# EAGLE board Panel (EAGLE 7.5.0)
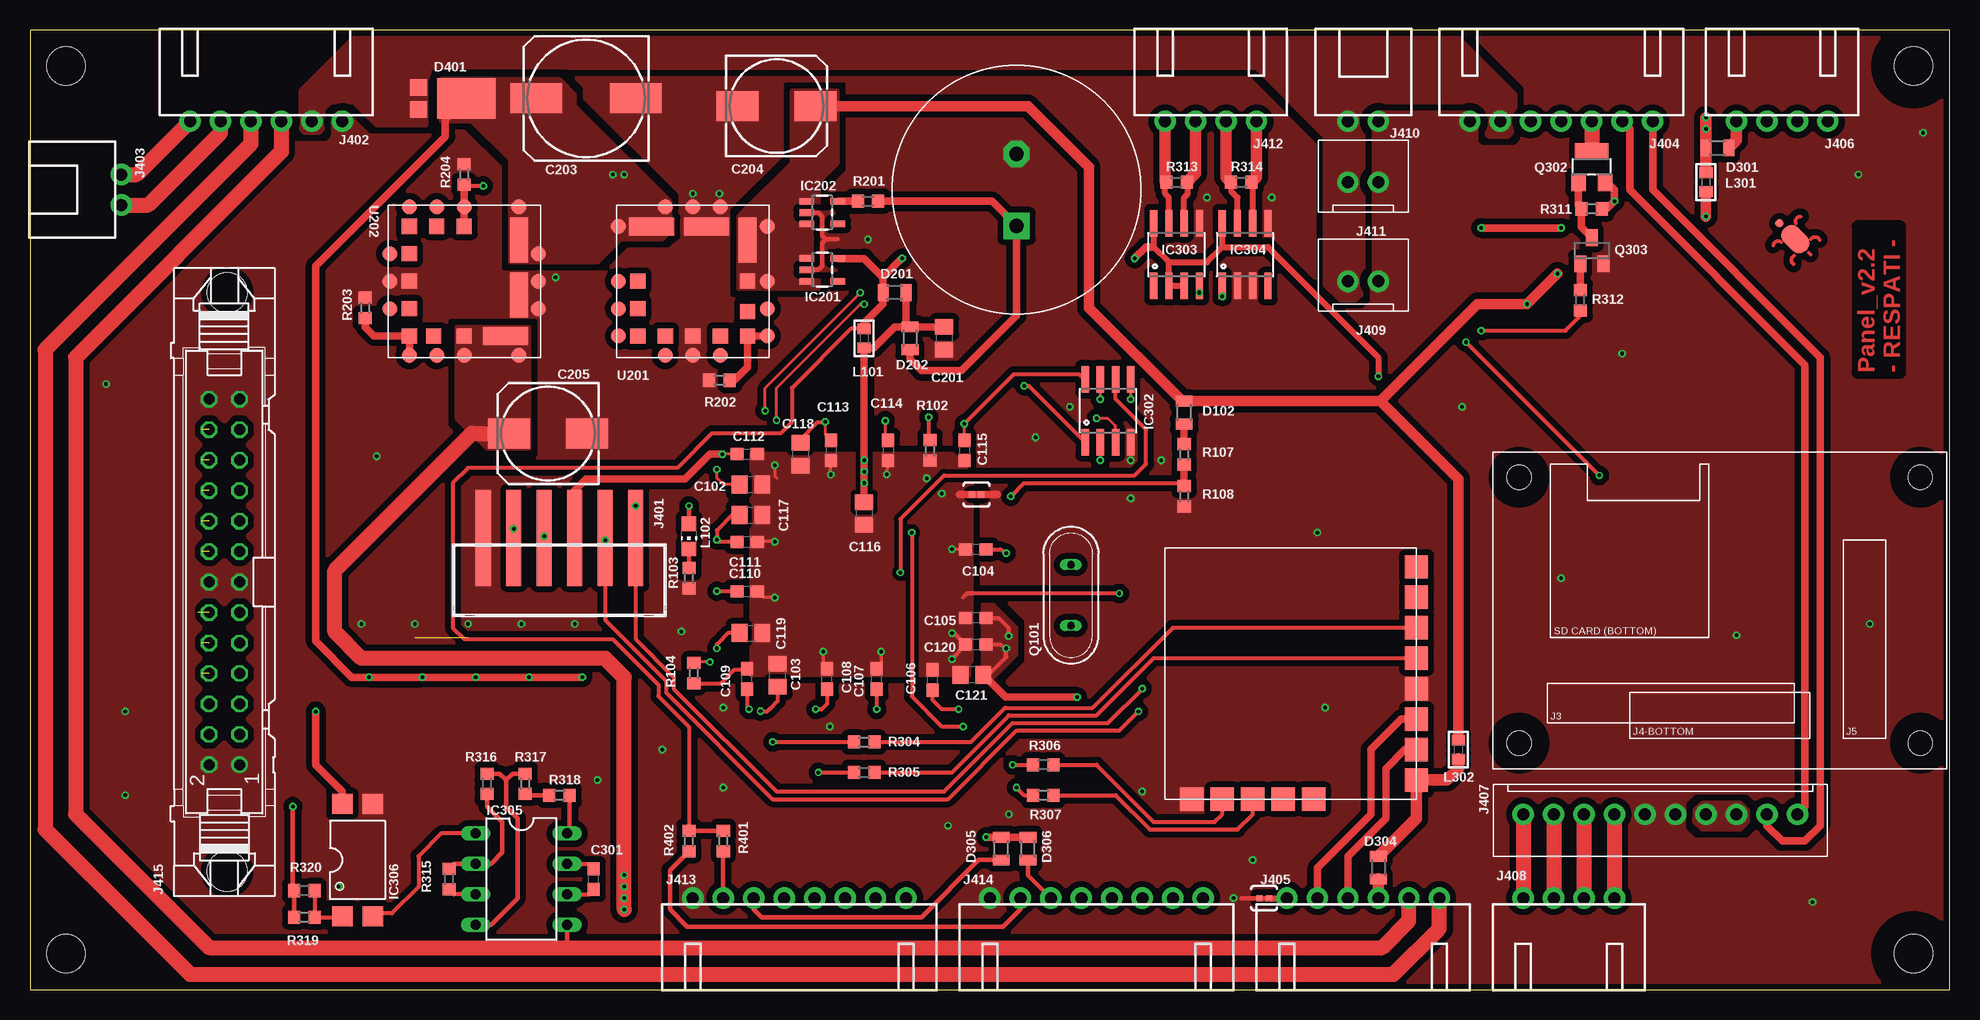
[diagram p4: board, top side]
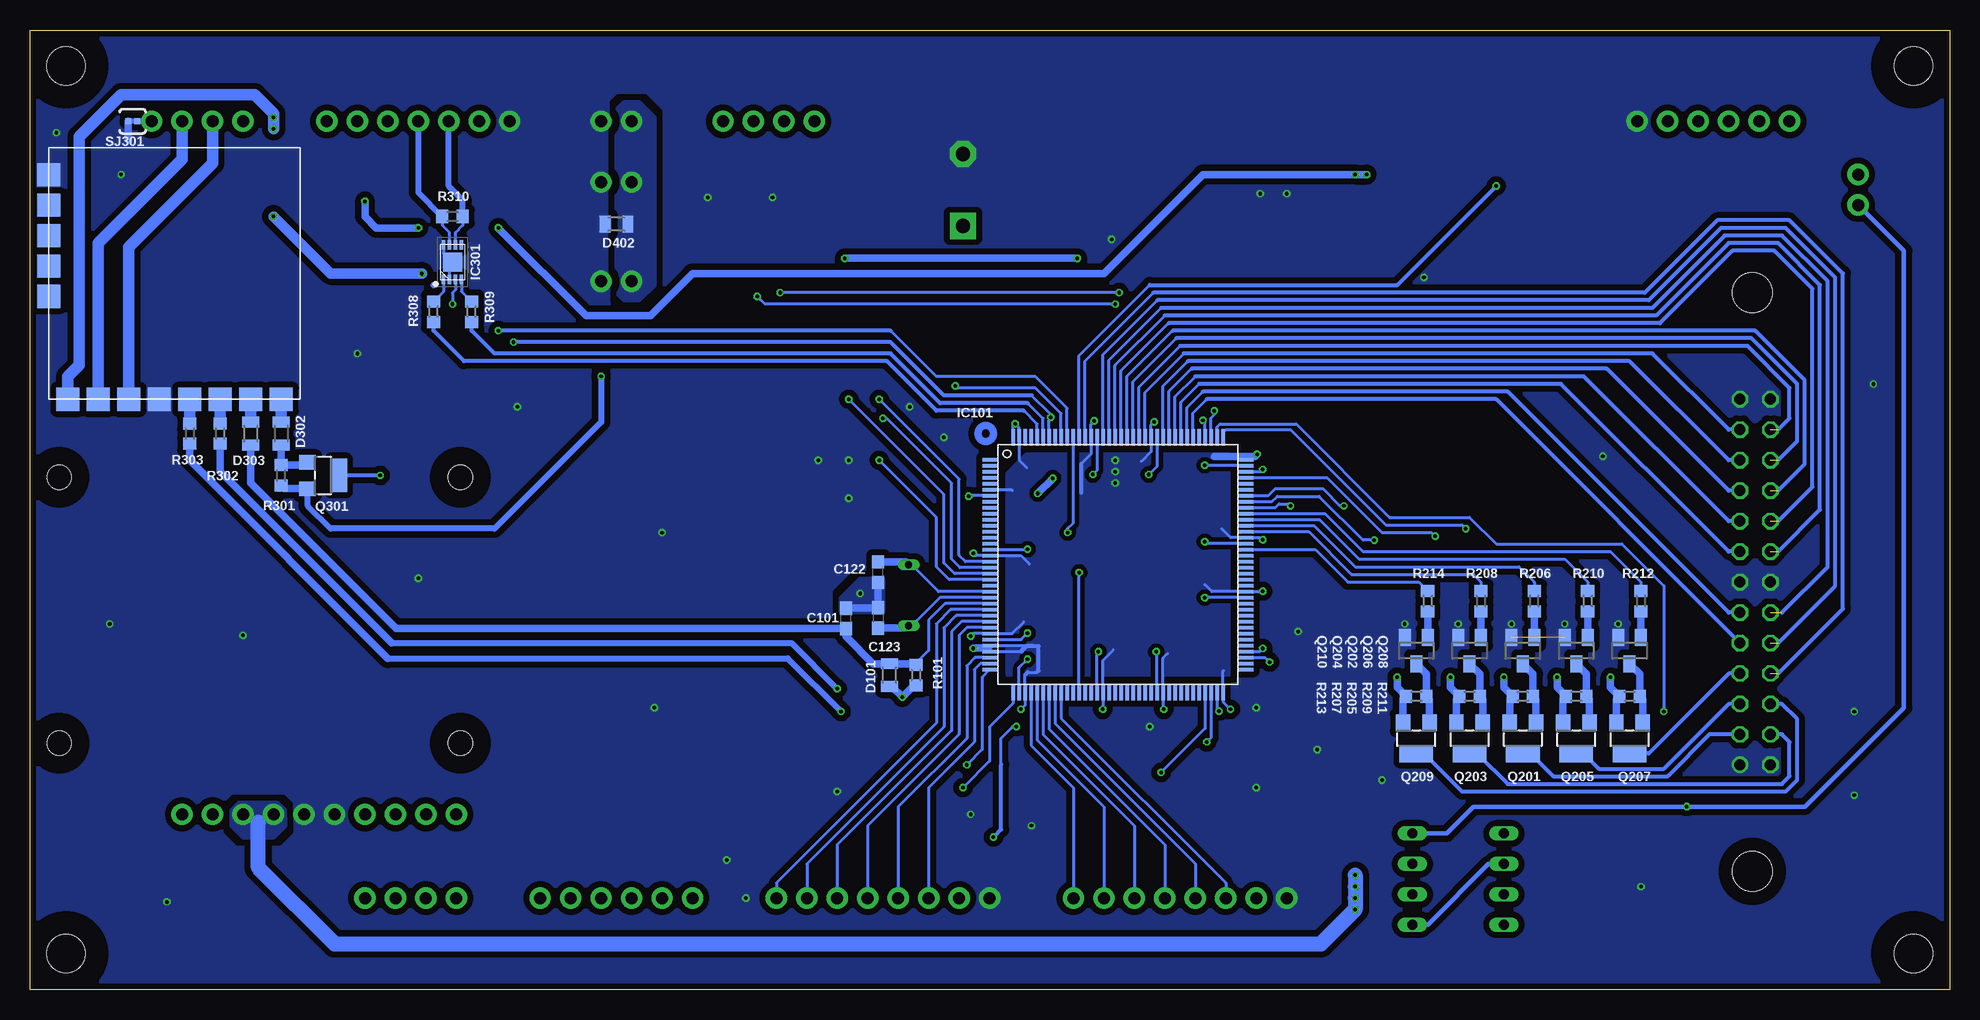
[diagram p5: board, bottom side, seen from below]

Size 160 x 80 mm. Coordinates in mm from the lower left corner, seen from the top.
Outline: 0,0 160,0 160,80 0,80 0,0
Copper layers (1*16): Top 0.035mm / dielectric 1.5mm / Bottom 0.035mm
Design rules "pcbgogo": minimum track width 6mil, minimum drill 0.3mm, track to track 6mil, track to pad 6mil, pad to pad 6mil, via to via 6mil, smd to smd 0mil, copper to edge 0.4mm, drill to drill 0.25mm, minimum pad ring 6mil, minimum via ring 6mil, stop-mask expansion 4mil, vias tented up to drill 0.35mm, thermal gap 10mil
Net classes: 0 default: width 0.203 mm, drill 0.29 mm, clearance 0.203 mm; 1 ic: width 0.203 mm, drill 0.29 mm, clearance 0.203 mm; 2 power: width 0.381 mm, drill 0.29 mm, clearance 0.635 mm
Holes 3.2 mm at 3,3 3,77 157,3 157,77
tRestrict: area 0,0 to 6,6; area 0,74 to 6,80; area 154,0 to 160,6; area 154,74 to 160,80
bRestrict: area 0,0 to 6,6; area 0,74 to 6,80; area 154,0 to 160,6; area 154,74 to 160,80

## Footprints (pad centres in the part's own frame; a part is rotated, then mirrored left to right if it is on the bottom)
C0603 = smd 1.1 x 1: 1 -0.85,0; 2 0.85,0
C0805 = smd 1.3 x 1.5: 1 -0.95,0; 2 0.95,0
SC_1F/5V5 = drill 1.2 pad 2.184 square: 1 3,0 | drill 1.2 pad 2.184 octagon: 2 -3,0
153CLV-1012 = smd 4.3 x 2.5: + 4.15,0; - -4.15,0
153CLV-0810 = smd 3.5 x 2.5: + 3.25,0; - -3.25,0
MICROMELF-W = smd 0.9 x 1.4: A 0.95,0; C -0.95,0
POWERDI5-3 = smd 1.39 x 1.4: 1 0.92,-2.856; 2 -0.92,-2.856 | smd 3.36 x 4.86: 3 0,1.126
LQFP144-2 = smd 0.297 x 1.35: 1 -8.75,-10.625; 2 -8.25,-10.625; 3 -7.75,-10.625; 4 -7.25,-10.625; 5 -6.75,-10.625; 6 -6.25,-10.625; 7 -5.75,-10.625; 8 -5.25,-10.625; 9 -4.75,-10.625; 10 -4.25,-10.625; 11 -3.75,-10.625; 12 -3.25,-10.625; 13 -2.75,-10.62; 14 -2.25,-10.625; 15 -1.75,-10.625; 16 -1.25,-10.625; 17 -0.75,-10.625; 18 -0.25,-10.625; 19 0.25,-10.625; 20 0.75,-10.625; 21 1.25,-10.625; 22 1.75,-10.625; 23 2.25,-10.625; 24 2.75,-10.62; 25 3.25,-10.625; 26 3.75,-10.625; 27 4.25,-10.625; 28 4.75,-10.625; 29 5.25,-10.625; 30 5.75,-10.625; 31 6.25,-10.625; 32 6.75,-10.625; 33 7.25,-10.625; 34 7.75,-10.625; 35 8.25,-10.625; 36 8.75,-10.625; 73 8.75,10.625; 74 8.25,10.625; 75 7.75,10.625; 76 7.25,10.625; 77 6.75,10.625; 78 6.25,10.625; 79 5.75,10.625; 80 5.25,10.625; 81 4.75,10.625; 82 4.25,10.625; 83 3.75,10.625; 84 3.25,10.625; 85 2.75,10.625; 86 2.25,10.625; 87 1.75,10.625; 88 1.25,10.625; 89 0.75,10.625; 90 0.25,10.625; 91 -0.25,10.625; 92 -0.75,10.625; 93 -1.25,10.625; 94 -1.75,10.625; 95 -2.25,10.625; 96 -2.75,10.625; 97 -3.25,10.625; 98 -3.75,10.625; 99 -4.25,10.625; 100 -4.75,10.625; 101 -5.25,10.625; 102 -5.75,10.625; 103 -6.25,10.625; 104 -6.75,10.625; 105 -7.25,10.625; 106 -7.75,10.625; 107 -8.25,10.625; 108 -8.75,10.625 | smd 1.35 x 0.297: 37 10.625,-8.75; 38 10.625,-8.25; 39 10.625,-7.75; 40 10.625,-7.25; 41 10.625,-6.75; 42 10.625,-6.25; 43 10.625,-5.75; 44 10.625,-5.25; 45 10.625,-4.75; 46 10.625,-4.25; 47 10.625,-3.75; 48 10.625,-3.25; 49 10.625,-2.75; 50 10.625,-2.25; 51 10.625,-1.75; 52 10.625,-1.25; 53 10.625,-0.75; 54 10.625,-0.25; 55 10.625,0.25; 56 10.625,0.75; 57 10.625,1.25; 58 10.625,1.75; 59 10.625,2.25; 60 10.625,2.75; 61 10.625,3.25; 62 10.625,3.75; 63 10.625,4.25; 64 10.625,4.75; 65 10.625,5.25; 66 10.625,5.75; 67 10.625,6.25; 68 10.625,6.75; 69 10.625,7.25; 70 10.625,7.75; 71 10.625,8.25; 72 10.625,8.75; 109 -10.625,8.75; 110 -10.625,8.25; 111 -10.625,7.75; 112 -10.625,7.25; 113 -10.625,6.75; 114 -10.625,6.25; 115 -10.625,5.75; 116 -10.625,5.25; 117 -10.625,4.75; 118 -10.625,4.25; 119 -10.625,3.75; 120 -10.625,3.25; 121 -10.625,2.75; 122 -10.625,2.25; 123 -10.625,1.75; 124 -10.625,1.25; 125 -10.625,0.75; 126 -10.625,0.25; 127 -10.625,-0.25; 128 -10.625,-0.75; 129 -10.625,-1.25; 130 -10.625,-1.75; 131 -10.625,-2.25; 132 -10.625,-2.75; 133 -10.625,-3.25; 134 -10.625,-3.75; 135 -10.625,-4.25; 136 -10.625,-4.75; 137 -10.625,-5.25; 138 -10.625,-5.75; 139 -10.625,-6.25; 140 -10.625,-6.75; 141 -10.625,-7.25; 142 -10.625,-7.75; 143 -10.625,-8.25; 144 -10.625,-8.75
SOT23-5 = smd 0.55 x 1.2: 1 -0.95,-1.3; 2 0,-1.3; 3 0.95,-1.3; 4 0.95,1.3; 5 -0.95,1.3
TDFN-8 = smd 0.8 x 0.29: 1 -1.45,0.75; 2 -1.45,0.25; 3 -1.45,-0.25; 4 -1.45,-0.75; 5 1.45,-0.75; 6 1.45,-0.25; 7 1.45,0.25; 8 1.45,0.75 | smd 1.6 x 1.6: 9 0,0
SO08 = smd 0.61 x 2.21: 1 -1.905,-2.616; 2 -0.635,-2.616; 3 0.635,-2.616; 4 1.905,-2.616; 5 1.905,2.616; 6 0.635,2.616; 7 -0.635,2.616; 8 -1.905,2.616
DIL08 = drill 0.813 long: 1 -3.81,-3.81; 2 -1.27,-3.81; 3 1.27,-3.81; 4 3.81,-3.81; 5 3.81,3.81; 6 1.27,3.81; 7 -1.27,3.81; 8 -3.81,3.81
PC817SMD = smd 1.68 x 1.71: 1 -4.695,1.27; 2 -4.695,-1.27; 3 4.695,-1.27; 4 4.695,1.27
XHS-6-VERT-SMD = smd 1.27 x 8: 1 6.35,0.5; 2 3.81,0.5; 3 1.27,0.5; 4 -1.27,0.5; 5 -3.81,0.5; 6 -6.35,0.5
XHS-6-RA = drill 1 pad 1.778: 1 6.35,0; 2 3.81,0; 3 1.27,0; 4 -1.27,0; 5 -3.81,0; 6 -6.35,0
XHS-2-RA = drill 1 pad 1.778: 1 1.27,0; 2 -1.27,0
XHS-7-RA = drill 1 pad 1.778: 1 7.62,0; 2 5.08,0; 3 2.54,0; 4 0,0; 5 -2.54,0; 6 -5.08,0; 7 -7.62,0
XHS-4-RA = drill 1 pad 1.778: 1 3.81,0; 2 1.27,0; 3 -1.27,0; 4 -3.81,0
XHS-10-VERT = drill 1 pad 1.778: 1 11.43,0; 2 8.89,0; 3 6.35,0; 4 3.81,0; 5 1.27,0; 6 -1.27,0; 7 -3.81,0; 8 -6.35,0; 9 -8.89,0; 10 -11.43,0
XHS-2-VERT = drill 1 pad 1.778: 1 1.27,0; 2 -1.27,0
XHS-8-RA = drill 1 pad 1.778: 1 8.89,0; 2 6.35,0; 3 3.81,0; 4 1.27,0; 5 -1.27,0; 6 -3.81,0; 7 -6.35,0; 8 -8.89,0
26V = drill 0.914: 1 -15.24,-1.27 | drill 0.914 octagon: 2 -15.24,1.27; 3 -12.7,-1.27; 4 -12.7,1.27; 5 -10.16,-1.27; 6 -10.16,1.27; 7 -7.62,-1.27; 8 -7.62,1.27; 9 -5.08,-1.27; 10 -5.08,1.27; 11 -2.54,-1.27; 12 -2.54,1.27; 13 0,-1.27; 14 0,1.27; 15 2.54,-1.27; 16 2.54,1.27; 17 5.08,-1.27; 18 5.08,1.27; 19 7.62,-1.27; 20 7.62,1.27; 21 10.16,-1.27; 22 10.16,1.27; 23 12.7,-1.27; 24 12.7,1.27; 25 15.24,-1.27; 26 15.24,1.27 | hole 3.302: 24.13,-0.254; -24.13,-0.254
L0603 = smd 0.9 x 1.1: 1 -0.794,0; 2 0.794,0
CHIP-LED0805 = smd 1.2 x 1.2: A 0,-1.05; C 0,1.05
QS = drill 0.61 long: 1 -2.54,0; 2 2.54,0
SOT23-W = smd 1.2 x 1.4: 1 -1.1,-1.3; 2 1.1,-1.3 | smd 2.8 x 1.4: 3 0,1.3
SOT23 = smd 1 x 1.4: 1 -0.95,-1.1; 2 0.95,-1.1; 3 0,1.1
R0603 = smd 1 x 1.1: 1 -0.85,0; 2 0.85,0
SJ_2S-TRACE_THICK = smd 0.5 x 0.5: 1 -0.381,0; 2 0.381,0
OKL2T/3W5NC = smd 1.27 x 1.27: 1 -6.2,0; 1@1 -4.57,0; 2 -2.29,6.2; 2@1 -6.2,4.57; 3 0,6.2; 3@1 2.29,6.2; 4 6.2,4.57; 5 6.2,0; 5@1 4.57,0; 6 6.2,-4.57; 6@1 4.57,-4.57; 7 0,-6.2; 7@1 0,-4.57; 8 -2.29,-6.2; 8@1 -2.29,-4.57; 9 -6.2,-4.57; 9@1 -4.57,-4.57; 10 -6.2,-2.29; 10@1 -4.57,-2.29; 11 6.2,-2.29; 11@1 4.57,-2.54; 12 2.29,-6.2; 12@1 2.29,-4.57 | smd 3.75 x 1.5: 2@2 -3.43,4.57; 3@2 1.14,4.57 | smd 1.5 x 3.75: 4@1 4.57,3.43
MOD_CP2105_BOARD = smd 1.93 x 1.93: 1 -10.477,8.89; 2 -10.477,6.35; 3 -10.477,3.81; 4 -10.477,1.27; 5 -10.477,-1.27; 6 -10.477,-3.81; 7 -10.477,-6.35; 8 -10.477,-8.89; 9 8.255,10.477; 10 5.715,10.477; 11 3.175,10.477; 12 0.635,10.477; 13 -1.905,10.477
SLA-1500-OEM = hole 2: 2.21,2.121; 2.21,24.295; 35.636,24.295; 35.636,2.121
KURRO-LOGO = smd 2.54 x 1.651 rotated 45 bottom: P$1 0,0 | smd 0.635 x 0.635 rotated 45 bottom: P$2 1.347,1.347

## Placement (x,y rotation side)
C101  100n  [C0603]  91.98,30.93 90 bottom
C102  2u2  [C0805]  60.1,42.09 0 top
C103  2u2  [C0805]  62.32,26.22 90 top
C104  100n  [C0603]  78.83,36.69 180 top
C105  100n  [C0603]  78.83,30.98 180 top
C106  100n  [C0603]  75.23,25.81 90 top
C107  100n  [C0603]  70.58,25.9 90 top
C108  100n  [C0603]  66.45,25.9 90 top
C109  100n  [C0603]  59.78,25.9 90 top
C110  100n  [C0603]  59.78,33.2 0 top
C111  100n  [C0603]  59.78,37.33 0 top
C112  100n  [C0603]  59.78,44.63 0 top
C113  100n  [C0603]  66.77,44.95 270 top
C114  100n  [C0603]  71.53,44.95 270 top
C115  100n  [C0603]  77.88,44.95 270 top
C116  4u7  [C0805]  69.53,39.69 270 top
C117  1u  [C0805]  60.1,39.55 0 top
C118  1u  [C0805]  64.23,44.63 270 top
C119  2u2  [C0805]  60.1,29.71 0 top
C120  100n  [C0603]  78.83,28.76 180 top
C121  1u  [C0805]  78.51,26.22 180 top
C122  22p  [C0603]  89.31,34.79 90 bottom
C123  22p  [C0603]  89.31,30.98 270 bottom
C201  10u  [C0805]  76.2,54.29 270 top
C202  1F5/5V5  [SC_1F/5V5]  82.23,66.67 270 top
C203  470u/35V  [153CLV-1012]  46.35,74.3 180 top
C204  1000u/6V3  [153CLV-0810]  62.23,73.66 0 top
C205  1000u/6V3  [153CLV-0810]  43.18,46.35 180 top
C301  100n  [C0603]  46.99,9.21 90 top
D101  SCHOTTKY  [MICROMELF-W]  88.36,26.22 90 bottom
D102  SCHOTTKY  [MICROMELF-W]  96.2,48.1 90 top
D201  SCHOTTKY  [MICROMELF-W]  72.07,58.1 180 top
D202  SCHOTTKY  [MICROMELF-W]  73.34,54.29 270 top
D301  SCHOTTKY  [MICROMELF-W]  140.65,70.17 0 top
D302  SCHOTTKY  [MICROMELF-W]  139.06,46.35 270 bottom
D303  SCHOTTKY  [MICROMELF-W]  141.6,46.35 270 bottom
D304  SCHOTTKY  [MICROMELF-W]  112.39,10.16 270 top
D305  SCHOTTKY  [MICROMELF-W]  80.96,11.75 90 top
D306  SCHOTTKY  [MICROMELF-W]  83.19,11.75 90 top
D401  SDT5100LP5  [POWERDI5-3]  35.24,74.3 270 top
D402  SCHOTTKY  [MICROMELF-W]  111.12,63.82 180 bottom
IC101  STM32F723ZET  [LQFP144-2]  69.31,35.42 270 bottom
IC201  TLV73333P  [SOT23-5]  66.04,60.01 270 top
IC202  TLV73333P  [SOT23-5]  66.04,64.77 270 top
IC301  MCP2544FDT-E  [TDFN-8]  124.78,60.64 90 bottom
IC302  W25R128JVS  [SO08]  89.85,48.26 0 top
IC303  RS485SOIC  [SO08]  95.57,61.28 0 top
IC304  RS485SOIC  [SO08]  101.28,61.28 0 top
IC305  AD654P  [DIL08]  40.96,9.21 270 top
IC306  PC817SMD_S1  [PC817SMD]  27.3,10.79 90 top
J401  PROG_DEBUG  [XHS-6-VERT-SMD]  44.13,37.15 0 top
J402  PDU  [XHS-6-RA]  19.68,72.39 0 top
J403  KONTAK_EMERGENCY  [XHS-2-RA]  7.62,66.67 90 top
J404  BUS  [XHS-7-RA]  127.64,72.39 0 top
J405  PC  [XHS-6-RA]  111.12,7.62 180 top
J406  PROG_EXTERNAL  [XHS-4-RA]  146.05,72.39 0 top
J407  SLA-1500-SONY  [XHS-10-VERT]  135.89,14.61 180 top
J408  SLA-1500-ETH  [XHS-4-RA]  128.27,7.62 180 top
J409  FAN  [XHS-2-VERT]  111.12,59.05 0 top
J410  MONITOR  [XHS-2-RA]  111.12,72.39 0 top
J411  ETH_HUB  [XHS-2-VERT]  111.12,67.31 0 top
J412  BMS  [XHS-4-RA]  98.42,72.39 0 top
J413  JOYSTICK_LEFT  [XHS-8-RA]  64.14,7.62 180 top
J414  JOYSTICK_RIGHT  [XHS-8-RA]  88.9,7.62 180 top
J415  BUTTON  [26V]  16.19,33.97 90 top
L101  FB_0603  [L0603]  69.53,54.29 270 top
L102  GREEN  [CHIP-LED0805]  54.93,37.78 180 top
L301  FB_0603  [L0603]  139.7,67.31 270 top
L302  FB_0603  [L0603]  119.06,20 90 top
Q101  8MHz  [QS]  86.77,32.88 90 top
Q201  BSS215PH6327XT  [SOT23-W]  35.56,20.95 180 bottom
Q202  2N2222  [SOT23]  35.56,28.26 180 bottom
Q203  BSS215PH6327XT  [SOT23-W]  40.01,20.95 180 bottom
Q204  2N2222  [SOT23]  40.01,28.26 180 bottom
Q205  BSS215PH6327XT  [SOT23-W]  31.11,20.95 180 bottom
Q206  2N2222  [SOT23]  31.11,28.26 180 bottom
Q207  BSS215PH6327XT  [SOT23-W]  26.67,20.95 180 bottom
Q208  2N2222  [SOT23]  26.67,28.26 180 bottom
Q209  BSS215PH6327XT  [SOT23-W]  44.45,20.95 180 bottom
Q210  2N2222  [SOT23]  44.45,28.26 180 bottom
Q301  BSS215PH6327XT  [SOT23-W]  135.57,42.86 270 bottom
Q302  BSS215PH6327XT  [SOT23-W]  130.18,68.58 0 top
Q303  2N2222  [SOT23]  130.18,61.59 0 top
R101  100K  [R0603]  86.13,26.22 90 bottom
R102  100K  [R0603]  75.02,44.95 270 top
R103  330R  [R0603]  54.93,34.29 90 top
R104  3k  [R0603]  55.34,26.37 90 top
R107  10k  [R0603]  96.2,44.61 270 top
R108  10k  [R0603]  96.2,41.12 90 top
R201  120R  [R0603]  69.85,65.72 0 top
R202  2k2  [R0603]  57.47,50.8 0 top
R203  2k2  [R0603]  27.94,56.83 270 top
R204  100k  [R0603]  36.2,67.94 270 top
R205  100k  [R0603]  35.56,24.45 180 bottom
R206  1k  [R0603]  34.61,32.38 90 bottom
R207  100k  [R0603]  40.01,24.45 180 bottom
R208  1k  [R0603]  39.05,32.38 90 bottom
R209  100k  [R0603]  31.11,24.45 180 bottom
R210  1k  [R0603]  30.16,32.38 90 bottom
R211  100k  [R0603]  26.67,24.45 180 bottom
R212  1k  [R0603]  25.72,32.38 90 bottom
R213  100k  [R0603]  44.45,24.45 180 bottom
R214  1k  [R0603]  43.5,32.38 90 bottom
R301  100k  [R0603]  139.06,42.86 270 bottom
R302  120R  [R0603]  144.15,46.35 90 bottom
R303  120R  [R0603]  146.69,46.35 90 bottom
R304  120R  [R0603]  69.53,20.64 0 top
R305  120R  [R0603]  69.53,18.1 0 top
R306  120R  [R0603]  84.45,18.73 0 top
R307  120R  [R0603]  84.45,16.19 0 top
R308  120R  [R0603]  126.36,56.52 270 bottom
R309  120R  [R0603]  123.19,56.52 270 bottom
R310  120R  [R0603]  124.78,64.45 180 bottom
R311  100k  [R0603]  130.18,65.09 0 top
R312  1k  [R0603]  129.22,57.47 270 top
R313  120R  [R0603]  95.57,67.31 0 top
R314  120R  [R0603]  100.97,67.31 0 top
R315  10k  [R0603]  34.92,9.21 270 top
R316  10k  [R0603]  38.1,17.14 90 top
R317  10k  [R0603]  41.27,17.14 270 top
R318  10k  [R0603]  44.13,16.19 0 top
R319  10k  [R0603]  22.86,6.03 180 top
R320  10k  [R0603]  22.86,8.26 180 top
R401  470R  [R0603]  57.78,12.38 90 top
R402  470R  [R0603]  54.93,12.38 90 top
SJ101  CLOSED  [SJ_2S-TRACE_THICK]  78.9,41.27 0 top
SJ301  CLOSED  [SJ_2S-TRACE_THICK]  151.45,72.39 180 bottom
SJ302  CLOSED  [SJ_2S-TRACE_THICK]  102.87,7.62 0 top
U201  OKL-T/1-W12P-C  [OKL2T/3W5NC]  55.24,59.05 0 top
U202  OKL2T/3W5NC_SMD  [OKL2T/3W5NC]  36.2,59.05 270 top
U301  MOD_CP2105_BRD  [MOD_CP2105_BOARD]  147.96,59.69 90 bottom
U302  MOD_CP2105_BRD  [MOD_CP2105_BOARD]  105.09,26.35 180 top
U401  SLA-1500-OEM  [SLA-1500-OEM]  121.92,18.41 0 top
U402  SLA-1500-OEM-RESTRICT  [SLA_1500-OEM-RESTRICT]  121.92,18.41 0 top
U$2  KURRO_FOOTPRINT  [KURRO-LOGO]  147.16,62.55 0 bottom

## Tracks (layer width: path | path; a pad name or v marks a point on that pad's centre or on a via)
!RST
  Bottom 0.254: IC101.25 83.71,32.17 85.09,30.8 85.09,28.26 86.14,27.21 R101.2
  Bottom 0.635: R101.2 86.23,27.17 D101.A 89.71,27.17 91.98,29.43 C101.1 129.46,30.08 141.6,42.23 D303.A
+3V3  (via drill 0.3)
  Top 0.318: L101.1 68.42,55.09 63.5,50.16 63.5,47.31 62.55,46.35 56.83,46.35 53.98,43.5 36.51,43.5 35.24,42.23 35.24,30.16 36.2,29.21 48.58,29.21 52.39,25.4 52.39,24.45 54.93,21.91 R402.2
  Top 0.381: R401.2 R402.2
  Top 0.508: IC303.3 IC303.2 94.93,60.64 | IC303.8 93.66,61.91 94.93,60.64 | 94.93,60.64 98.11,60.64 99.38,61.91 | 99.38,61.91 IC304.8 | 99.38,61.91 103.19,61.91 112.39,52.7 v112.39,51.12
  Top 0.635: IC201.5 69.53,60.96 71.12,59.37 | 71.12,59.37 D201.A 71.12,57.15 69.53,55.56 L101.1 | 93.66,61.91 93.03,61.91 v92.08,60.96 | v72.71,60.96 71.12,59.37
  Bottom 0.508: v112.39,51.12 112.39,47.31 121.28,38.42 134.94,38.42 136.84,40.32 136.84,41.73 Q301.2
  Bottom 0.635: Q301.2 138.81,41.76 R301.2 | v92.08,60.96 v72.71,60.96
+5V  (via drill 0.3)
  Top 0.635: D102.A 96.05,49.05
  Top 0.889: L301.2 v139.7,64.45 | v127.32,59.69 v124.78,57.15 120.66,57.15 112.56,49.05 | D102.A 112.56,49.05 | 112.56,49.05 119.06,42.55 L302.2 | 96.05,49.05 88.27,56.83 88.27,68.58 83.19,73.66 C204.+
  Bottom 0.254: IC301.3 124.53,58.35 124.78,58.1 v124.78,57.15
  Bottom 0.889: v139.7,64.45 134.94,59.69 v127.32,59.69
  pour Top (isolate 0.508, rank 3, no thermals): 59.05,58.42 65.72,58.42 65.72,67.31 67.31,68.9 67.31,74.93 63.82,74.93 63.5,74.93 63.5,68.9 59.37,64.77 59.05,64.45
+12V  (via drill 0.3)
  Top 0.635: v46.04,26.04 v41.59,26.04 v37.15,26.04 v32.7,26.04 v28.26,26.04 26.83,26.04 23.81,29.05 23.81,60.33 34.61,71.12 34.61,72.53 D401.3 | v120.97,63.5 v127.64,63.5 | Q302.2 131.47,67.28 132.08,66.67 v132.08,65.72 131.44,65.09 R311.2
  Bottom 0.635: Q207.2 27.77,24.2 R211.2 28.26,25.18 v28.26,26.04 | Q205.2 32.22,24.2 R209.2 32.7,25.18 v32.7,26.04 | Q201.2 36.66,24.2 R205.2 37.15,25.18 v37.15,26.04 | Q203.2 41.1,24.2 R207.2 41.59,25.18 v41.59,26.04 | Q209.2 45.55,24.2 R213.2 46.04,25.18 v46.04,26.04 | v48.58,67.94 v49.53,67.94 62.23,67.94 70.48,59.69 104.78,59.69 108.27,56.2 113.67,56.2 v120.97,63.5 | v127.64,63.5 131.13,63.5 132.08,64.45 v132.08,65.72
  pour Top (isolate 0.508, rank 2, no thermals): 34.29,75.88 44.13,75.88 45.4,74.61 45.4,73.66 53.34,65.72 53.34,63.18 52.7,62.55 49.21,62.55 47.31,60.64 40.01,60.64 40.01,69.22 36.83,72.39 34.29,72.39
AGND  (via drill 0.3)
  Top 0.254: v71.41,42.94 71.56,44.06 C114.2 | v66.74,42.94 66.74,44.07 C113.2 | v62.07,43.72 62.07,42.78 62.23,42.63 | v62.07,37.34 60.64,37.34 C111.2 | v62.07,32.67 61.16,32.67 C110.2 | v66.12,28.16 66.12,27.08 C108.2 | v70.94,28.16 70.94,27.11 C107.2 | v76.85,36.72 77.96,36.72 C104.2
  Top 0.318: v76.85,27.54 77.85,28.63 C120.2 77.02,29.71 v76.85,29.71 | R104.1 57.59,25.52 58.74,26.67 59.7,26.67 C109.2 | v90.81,33.02 78.11,33.02 77.79,32.7
  Top 0.635: 78.52,41.27 77.47,41.27
  Bottom 0.254: IC101.130 71.06,43.29 v71.41,42.94 | IC101.120 66.06,43.62 v66.74,42.94 | IC101.107 62.03,43.67 v62.07,43.72 | IC101.94 61.91,37.17 v62.07,37.34 | IC101.85 v62.07,32.67 | IC101.61 66.06,28.1 v66.12,28.16 | IC101.51 71.06,28.04 v70.94,28.16 | IC101.38 77.56,26.83 v76.85,27.54 | IC101.31 77.39,29.17 v76.85,29.71 | IC101.16 76.9,36.67 v76.85,36.72
  Bottom 0.635: C122.1 C123.1 91.94,31.83 C101.2 | v74.74,42.62 v76.01,41.35
  pour Top (isolate 0.381, rank 5, no thermals): 60.1,26.22 78.51,26.22 78.51,43.04 76.93,44.63 60.1,44.63
  pour Bottom (isolate 0.508, rank 5, no thermals): 88.9,31.43 92.39,31.43 92.39,32.7 90.81,34.29 88.9,34.29
BMS_RX+
  Top 0.508: IC303.6 96.2,66.04 96.52,66.36 96.52,67.21 R313.2
  Top 0.953: J412.3 97.16,68.05 R313.2
BMS_RX-
  Top 0.508: IC303.7 94.93,66.04 94.61,66.36 94.61,67.21 R313.1
  Top 0.953: J412.4 94.61,67.41 R313.1
BMS_RXD  (via drill 0.3)
  Top 0.254: v61.28,48.26 61.28,50.16 v69.22,58.1 | v97.47,58.1 IC303.4
  Bottom 0.254: IC101.111 61.56,47.66 61.28,47.94 v61.28,48.26 | v69.22,58.1 v97.47,58.1
BMS_TX+
  Top 0.508: IC304.6 101.92,67.21 R314.2
  Top 0.953: J412.1 102.23,67.73 R314.2
BMS_TX-
  Top 0.508: IC304.7 100.65,66.04 100.11,66.57 R314.1
  Top 0.953: J412.2 99.69,67.73 R314.1
BMS_TXD  (via drill 0.3)
  Top 0.254: v62.23,47.47 62.23,50.16 69.22,57.15 v69.53,57.15 | v99.38,57.78 IC304.1
  Bottom 0.254: IC101.112 62.06,47.29 v62.23,47.47 | 99.06,57.47 v99.38,57.78 98.74,57.15 v69.53,57.15
BOOT0  (via drill 0.3)
  Top 0.318: v74.91,47.72 74.91,45.91 R102.1 | v119.7,53.98 v130.81,42.86
  Bottom 0.254: 76.52,49.53 74.91,47.92 v74.91,47.72 75.06,47.57 IC101.138
  Bottom 0.318: 76.52,49.53 83.82,49.53 88.27,53.98 v119.7,53.98 | v130.81,42.86 Q301.3
BUS_CANH
  Bottom 0.254: IC301.7 125.03,63.12 125.63,63.72 R310.2
  Bottom 0.508: J404.4 127.64,66.46 R310.2
BUS_CANL
  Bottom 0.254: IC301.6 124.53,63.12 123.93,63.72 R310.1
  Bottom 0.508: R310.1 123.93,65.83 125.09,66.99 J404.5
BUS_RXD
  Bottom 0.254: IC101.139 75.56,47.62 76.83,48.9
  Bottom 0.318: 76.83,48.9 84.14,48.9 88.27,53.02 121.28,53.02 123.19,54.93 R309.2
BUS_TRIGGER_PULSE
  Top 1.27: J404.3 Q302.3
BUS_TXD
  Bottom 0.254: IC101.140 76.06,47.16 77.15,48.26
  Bottom 0.318: 77.15,48.26 84.45,48.26 88.58,52.39 123.83,52.39 126.36,54.93 R308.2
BUS_VIDEO_GND
  Top 0.635: J407.9 144.78,13.65 146.05,12.38 147.96,12.38 149.22,13.65 149.22,52.7 135.25,66.67 J404.1
BUS_VIDEO_OUT
  Top 0.635: J407.10 147.96,15.24 147.96,52.07 133.35,66.67 133.35,71.75 J404.2
DUAL_TRIG_IN  (via drill 0.3)
  Top 0.318: v73.5,38.1 73.5,24.45 76.04,21.91 v77.79,21.91
  Top 0.635: D306.A D305.A v79.69,12.7
  Bottom 0.254: IC101.134 73.06,38.86 73.5,38.42 v73.5,38.1 | 79.06,18.73 79.06,20.95 78.11,21.91 v77.79,21.91
  Bottom 0.318: 79.06,18.73 79.06,13.34 v79.69,12.7
GND  (via drill 0.3)  (1 unrouted)
  Top 0.381: IC202.2 65.72,64.77 66.04,64.45 66.04,62.87 66.36,62.55 | IC201.2 65.72,60.01 66.04,60.33 66.04,62.23 66.36,62.55 | 66.36,62.55 67.31,62.55 | 102.49,7.62 100.97,7.62
  Top 0.635: SJ101.1 80.64,41.27
  Bottom 0.254: IC301.8 125.53,61.39 IC301.9 125.03,60.39 IC301.2
  Bottom 0.635: SJ301.2 151.83,70.87 151.76,70.8
  other vias: 157.8,71.44 152.4,67.94 27.62,30.48 32.07,30.48 36.51,30.48 40.96,30.48 45.4,30.48 98.11,66.04 91.76,44.13 100.33,7.62 92.71,16.51 103.5,66.04 69.85,62.55 91.76,40.96 94.3,44.13 83.82,46.04 86.68,48.58 54.29,29.84 52.7,20 47.31,17.46 57.78,16.83 57.78,23.5 66.67,21.91 76.52,13.65 81.6,14.61 101.92,10.79 107.95,23.5 107.31,38.1 6.35,50.48 119.38,48.58 132.72,53.02 127.64,34.29 142.24,29.53 153.35,30.48 148.59,7.3 7.94,23.18 7.94,16.19 25.72,8.57 28.89,44.45 55.24,66.36 57.47,66.36 43.81,59.37
  pour Top (isolate 0.508, rank 6, no thermals): 0,0 160,0 160,80 0,80
  pour Bottom (isolate 0.508, rank 6, no thermals): 0,0 160,0 160,80 0,80
IN_CAMERA_SELECT  (1 unrouted)
  Bottom 0.254: IC101.127 69.56,52.05 65.41,56.2
  Bottom 0.318: 14.29,36.51 10.79,40.01 10.79,58.74 14.29,62.23 18.41,62.23 24.45,56.2 65.41,56.2
IN_FIRE_MODE0  (1 unrouted)
  Bottom 0.254: IC101.124 68.06,50.69 64.45,54.29
  Bottom 0.318: 14.29,44.13 12.7,45.72 12.7,50.48 16.51,54.29 64.45,54.29
IN_FIRE_MODE1
  Bottom 0.254: IC101.119 65.56,50.33 63.5,52.39
  Bottom 0.318: J415.21 18.41,44.13 26.67,52.39 63.5,52.39
IN_FOCUS_FAR
  Bottom 0.254: IC101.117 64.56,49.42 62.87,51.12
  Bottom 0.318: J415.17 18.41,39.05 30.48,51.12 62.87,51.12
IN_FOCUS_NEAR  (1 unrouted)
  Bottom 0.254: IC101.126 69.06,51.59 65.09,55.56
  Bottom 0.318: 14.29,39.05 11.43,41.91 11.43,58.42 14.61,61.59 18.1,61.59 24.13,55.56 65.09,55.56
IN_LRF_ENABLE  (1 unrouted)
  Bottom 0.254: IC101.129 70.56,52.95 66.04,57.47
  Bottom 0.318: 14.29,28.89 9.53,33.66 9.53,59.37 13.65,63.5 19.05,63.5 25.08,57.47 66.04,57.47
IN_LRF_MAN_DOWN  (1 unrouted)
  Bottom 0.254: IC101.128 70.06,52.5 65.72,56.83
  Bottom 0.318: 13.97,31.43 10.16,35.24 10.16,59.05 13.97,62.87 18.73,62.87 24.77,56.83 65.72,56.83
IN_LRF_MAN_UP
  Bottom 0.254: IC101.115 63.56,48.52 62.23,49.85
  Bottom 0.318: J415.11 18.41,31.43 36.83,49.85 62.23,49.85
IN_LRF_START
  Bottom 0.254: IC101.114 63.06,48.07 61.91,49.21
  Bottom 0.318: 61.91,49.21 37.78,49.21 J415.9
IN_RESV  (1 unrouted)
  Bottom 0.254: IC101.132 72.06,52.4 66.36,58.1
  Bottom 0.318: 14.29,26.35 8.89,31.75 8.89,59.69 13.34,64.14 19.37,64.14 25.4,58.1 66.36,58.1
IN_SPD0  (1 unrouted)
  Bottom 0.254: IC101.123 67.56,50.23 64.14,53.66
  Bottom 0.318: 14.29,46.67 13.34,47.62 13.34,50.16 16.83,53.66 64.14,53.66
IN_SPD1
  Bottom 0.254: IC101.122 67.06,49.78 63.82,53.02
  Bottom 0.318: J415.23 18.41,46.67 24.77,53.02 63.82,53.02
IN_TARGET_NEXT
  Bottom 0.254: IC101.118 65.06,49.88 63.18,51.75
  Bottom 0.318: J415.19 18.41,41.59 28.57,51.75 63.18,51.75
IN_TARGET_PREV  (1 unrouted)
  Bottom 0.254: IC101.125 68.56,51.14 64.77,54.93
  Bottom 0.318: 14.29,41.59 12.06,43.81 12.06,50.8 16.19,54.93 64.77,54.93
IN_TRIGGER_ENABLE
  Bottom 0.254: IC101.116 64.06,48.97 62.55,50.48
  Bottom 0.318: J415.15 18.41,36.51 32.38,50.48 62.55,50.48
JSL_A
  Bottom 0.254: IC101.43 75.06,21.72 65.41,12.06 J413.5
JSL_AZIMUTH
  Bottom 0.254: IC101.41 76.06,20.81 70.48,15.24 J413.7
JSL_B
  Bottom 0.254: IC101.44 74.56,22.17 62.87,10.48 J413.4
JSL_DEADMAN
  Bottom 0.254: IC101.40 76.56,20.36 73.03,16.83 J413.8
JSL_ELEVATION
  Bottom 0.254: IC101.42 75.56,21.27 67.94,13.65 J413.6
JSL_TRIG
  Top 0.381: J413.3 60.33,6.67 60.96,6.03 74.3,6.03 79.06,10.79 D305.C
  Bottom 0.254: IC101.45 74.06,22.62 60.33,8.89 J413.3
JSR_A
  Bottom 0.254: IC101.29 81.9,30.17 82.55,29.53 82.55,21.27 90.17,13.65 J414.5
JSR_AZIMUTH
  Bottom 0.254: IC101.27 82.81,31.17 83.82,30.16 83.82,21.91 95.25,10.48 J414.7
JSR_B
  Bottom 0.254: IC101.34 81.23,27.67 81.92,26.99 81.92,20.95 87.63,15.24 J414.4
JSR_DEADMAN
  Bottom 0.254: IC101.26 83.26,31.67 84.45,30.48 84.45,22.23 97.79,8.89 J414.8
JSR_ELEVATION
  Bottom 0.254: IC101.28 82.36,30.67 83.19,29.84 83.19,21.59 92.71,12.06 J414.6
JSR_TRIG
  Top 0.318: J414.3 83.19,9.53
  Top 0.381: 83.19,9.53 D306.C
  Bottom 0.254: IC101.35 80.78,27.17 81.28,26.67 81.28,20.64 85.09,16.83 J414.3
N$1  (via drill 0.3)
  Top 0.254: v56.67,27.3 55.42,27.3 R104.2
  Bottom 0.254: IC101.75 57.04,27.67 v56.67,27.3
N$2
  Top 0.635: Q302.1 129.07,65.34 R311.1 129.32,63.55 Q303.3
N$3
  Top 0.635: Q303.1 R312.1
N$4
  Bottom 0.254: IC301.1 125.53,58.2 R308.1
N$5
  Bottom 0.254: IC301.4 124.03,58.2 R309.1
N$6
  Top 0.635: R202.2 58.74,50.8 59.81,51.88 U201.6@1 U201.6
N$7
  Top 0.635: IC202.5 R201.1
N$8
  Bottom 0.953: R303.2 U301.5
N$9
  Top 0.381: L102.C R103.2
N$10
  Top 0.381: R402.1 53.34,9.95 53.34,6.67 54.77,5.24 81.12,5.24 82.55,6.67 J414.2
N$11
  Top 0.381: J413.2 R401.1
N$12  (via drill 0.3)
  Top 0.381: L102.A v54.93,40.32
  Bottom 0.254: IC101.100 56.19,40.17 55.88,40.48 55.09,40.48 v54.93,40.32
N$13  (via drill 0.3)
  Top 0.318: C119.1 58.18,29.71 57.25,28.78 57.25,28.45 v57.24,28.44
  Bottom 0.254: IC101.76 57.51,28.17 v57.24,28.44
N$14
  Bottom 0.254: IC101.24 84.17,32.67 86.5,30.34 Q101.1
  Bottom 0.635: C123.2 86.98,30.13 Q101.1
N$15
  Top 0.318: IC305.1 34.29,13.02 32.38,11.11 32.38,8.57 30.16,6.35 28.82,6.35 IC306.2
N$16
  Bottom 0.254: IC101.23 84.29,33.17 86.54,35.42 Q101.2
  Bottom 0.635: C122.2 86.98,35.64 Q101.2
N$17
  Bottom 0.635: Q209.1 43.35,24.2 R213.1 43.6,26.31 Q210.3
N$18
  Bottom 0.635: Q201.1 34.46,24.2 R205.1 34.71,26.31 Q202.3
N$19
  Bottom 0.953: R302.2 U301.6
N$20
  Bottom 0.635: R206.1 Q202.1
N$21
  Bottom 0.635: Q203.1 38.91,24.2 R207.1 39.16,26.31 Q204.3
N$22
  Bottom 0.953: D303.C U301.7
N$23
  Bottom 0.953: U301.8 D302.C
N$24  (via drill 0.3)
  Top 0.953: L301.1 D301.C v139.7,72.7 v139.7,72.71
  Bottom 0.953: U301.1 156.84,51.12 155.89,52.07 155.89,71.12 152.4,74.61 141.29,74.61 139.7,73.03 v139.7,72.71 v139.7,71.75
N$25
  Bottom 0.635: Q301.1 137.12,43.71 R301.1 D302.A
N$26
  Top 0.318: U302.5 93.66,27.62 88.9,22.86 81.6,22.86 76.83,18.1 R305.2
N$27
  Top 0.318: U302.6 95.25,30.16 88.58,23.5 81.28,23.5 78.42,20.64 R304.2
N$28
  Top 0.318: U302.10 99.38,14.61 98.74,13.97 93.66,13.97 88.9,18.73 R306.2
N$29
  Top 0.318: U302.11 101.92,14.61 100.65,13.34 93.34,13.34 90.49,16.19 R307.2
N$30
  Top 0.318: R320.1 R319.1 25.97,6.03 IC306.1
N$31
  Top 0.953: D304.C 115.57,14.29 U302.1 118.11,17.46 119.06,18.41 L302.1
N$32
  Bottom 0.635: R208.1 Q204.1
N$33
  Bottom 0.635: R214.1 Q210.1
N$34
  Top 0.635: R107.1 D102.C
N$35
  Top 0.318: IC305.3 35.34,7.94 R315.2
N$37
  Top 0.318: IC305.7 46.57,10.48 C301.2
N$38
  Top 0.318: IC305.6 46.57,7.94 C301.1
N$39
  Top 0.381: R316.2 39.16,18 39.69,17.46 | 39.69,17.46 39.69,15.24 40.64,14.29 40.64,7.62 38.42,5.4 IC305.4 | R317.1 40.22,18 39.69,17.46
N$41
  Top 0.381: R318.1 41.38,16.19 R317.2
N$48
  Bottom 0.635: Q205.1 30.02,24.2 R209.1 30.27,26.31 Q206.3
N$49
  Bottom 0.635: R210.1 Q206.1
N$51
  Bottom 0.635: Q207.1 25.57,24.2 R211.1 25.82,26.31 Q208.3
N$52
  Bottom 0.635: R212.1 Q208.1
N$53
  Top 0.635: R203.2 27.94,55.24 28.7,54.48 U202.6@1 U202.6
OUT_CAMERA_SELECT
  Bottom 0.254: IC101.98 52.51,39.17 49.21,35.88 32.07,35.88 30.16,33.97 R210.2
OUT_CAMERA_SELECT_LED
  Bottom 0.318: J415.5 18.41,23.81 23.81,18.41 29.21,18.41 30.45,19.66 Q205.3
OUT_LRF_ENABLE
  Bottom 0.254: R212.2 25.72,33.97 28.26,36.51 48.9,36.51 52.06,39.67 IC101.99
OUT_LRF_ENABLE_LED
  Bottom 0.318: J415.7 18.41,26.35 25.08,19.68 26.64,19.68 Q207.3 26.8,19.68
OUT_POWER
  Bottom 0.254: IC101.97 52.96,38.67 49.53,35.24 35.88,35.24 34.61,33.97 R206.2
OUT_POWER_LED
  Bottom 0.318: J415.3 20,21.27 23.5,17.78 33.02,17.78 34.9,19.66 Q201.3
OUT_RESV
  Bottom 0.254: IC101.93 52.87,36.67 50.16,33.97 44.23,33.97 R214.2
OUT_RESV_LED
  Bottom 0.318: J415.6 13.97,23.81 12.7,22.54 12.7,17.46 13.65,16.51 40.64,16.51 43.78,19.66 Q209.3
OUT_TRIGGER
  Bottom 0.254: IC101.96 53.41,38.17 49.85,34.61 39.69,34.61 39.05,33.97 R208.2
OUT_TRIGGER_LED
  Bottom 0.318: J415.4 13.97,21.27 13.34,20.64 13.34,17.78 13.97,17.14 36.83,17.14 39.34,19.66 Q203.3
PC_E_RXD  (via drill 0.3)
  Top 0.318: v65.72,18.1 R305.1
  Bottom 0.254: IC101.69 62.06,21.76 v65.72,18.1
PC_E_TXD  (via drill 0.3)
  Top 0.318: v61.91,20.64 R304.1
  Bottom 0.254: IC101.70 61.56,20.99 v61.91,20.64
PC_S_RXD  (via drill 0.3)
  Top 0.318: v81.92,18.73 R306.1
  Bottom 0.254: IC101.36 80.01,26.67 80.64,26.04 80.64,20 v81.92,18.73
PC_S_TXD  (via drill 0.3)
  Top 0.318: v82.23,16.83 82.87,16.19 R307.1
  Bottom 0.254: IC101.37 78.06,23.86 80.01,21.91 80.01,19.05 v82.23,16.83
PC_USB_D+
  Top 0.635: J405.3 109.86,11.11 113.03,14.29 113.03,18.41 114.62,20 U302.2
PC_USB_D-
  Top 0.635: J405.2 107.31,10.16 111.76,14.61 111.76,20 114.3,22.54 U302.3
PC_USB_GND
  Top 0.508: 103.25,7.62 J405.1
PC_USB_V+
  Top 0.953: J405.4 D304.A
PROG_USB_D+
  Bottom 0.953: U301.2 154.31,62.23 147.32,69.22 J406.2
PROG_USB_D-
  Bottom 0.953: U301.3 151.76,61.91 144.78,68.9 J406.3
PROG_USB_GND
  Bottom 0.508: SJ301.1 J406.1
PROG_USB_V+
  Top 0.953: J406.4 142.24,70.81 D301.A
PWR_PC+
  Top 1.27: J402.4 18.41,70.48 1.27,53.34 1.27,13.34 13.34,1.27 113.67,1.27 117.47,5.08 J405.6
PWR_PC-
  Top 0.381: R315.1 35.34,10.48 IC305.2 38.42,10.48 39.37,11.43 39.37,13.97 38.1,15.24 R316.1 | IC305.5 44.77,3.49
  Top 1.27: J402.3 20.95,69.85 3.81,52.7 3.81,14.61 14.92,3.49 44.77,3.49 112.71,3.49 114.94,5.71 J405.5
  Bottom 0.381: IC305.2 38.42,10.48 43.5,5.4 IC305.5
RAW_+12V
  pour Top (isolate 0.508, rank 4, no thermals): 24.13,71.44 24.45,71.75 24.45,73.34 25.08,73.98 26.99,73.98 28.89,72.07 33.02,72.07 33.02,75.88 33.97,76.83 102.23,76.83 107.95,71.12 107.95,58.74 109.22,57.47 110.49,57.47 111.12,58.1 111.12,73.34 111.76,73.98 120.33,73.98 121.28,73.03 121.28,71.44 121.6,71.12 123.19,71.12 123.83,71.75 123.83,74.61 118.75,79.69 27.3,79.69 22.54,74.93 22.54,71.75 22.86,71.44
  pour Bottom (isolate 0.508, rank 4, no thermals): 109.22,57.47 110.49,57.47 111.12,58.1 111.12,73.34 110.49,73.98 109.22,73.98 107.95,72.71 107.95,58.74
SLA_POWER  (via drill 0.3)
  Top 1.27: v49.53,6.67 49.53,26.04 47.94,27.62 27.62,27.62 25.4,29.84 25.4,34.92 36.83,46.35 C205.+
  Bottom 1.27: v49.53,9.53 v49.53,8.57 v49.53,7.62 v49.53,6.67 52.39,3.81 134.62,3.81 140.97,10.16 140.97,13.97
  pour Top (isolate 0.508, rank 3, no thermals): 35.56,55.24 41.59,55.24 41.59,45.09 38.1,45.09 35.56,47.62
  pour Bottom (isolate 0.508, rank 5, no thermals): 139.38,15.56 142.56,15.56 143.19,14.92 143.19,13.65 142.24,12.7 139.7,12.7 138.75,13.65 138.75,14.92
  pour Top (isolate 0.508, rank 5, no thermals): 138.75,14.92 138.75,13.97 139.38,13.34 142.56,13.34 143.19,13.97 143.19,14.92 142.56,15.56 139.38,15.56
SLA_POWER_EN  (via drill 0.3)
  Top 0.318: v37.78,66.99 36.3,66.99 R204.2
  Top 0.635: U202.1@1 U202.1 R204.2
  Bottom 0.254: IC101.133 72.56,52.85 66.67,58.74
  Bottom 0.318: 66.67,58.74 46.04,58.74 v37.78,66.99
SLA_RX+
  Top 1.27: J407.3 J408.3
SLA_RX-
  Top 1.27: J407.4 J408.4
SLA_TX+
  Top 1.27: J407.2 J408.2
SLA_TX-
  Top 1.27: J407.1 J408.1
SWCLK  (via drill 0.3)
  Top 0.254: J401.5 v40.32,38.42
  Bottom 0.254: IC101.109 60.56,46.44 60.33,46.67 54.93,46.67 46.99,38.73 40.64,38.73 v40.32,38.42
SWDIO  (via drill 0.3)
  Top 0.254: J401.4 v42.86,37.78
  Bottom 0.254: IC101.105 51.88,42.67 47.31,38.1 43.18,38.1 v42.86,37.78
SYS_WKUP4  (via drill 0.3)
  Top 0.318: v81.76,41.12 82.87,42.23 95.94,42.23 R108.2
  Top 0.635: R107.2 R108.2
  Bottom 0.254: IC101.7 81.7,41.17 v81.76,41.12
TRIG_PULSE_OUT  (via drill 0.3)
  Top 0.318: R312.2 129.22,56.2 129.07,56.01 127.98,54.93 v120.97,54.93
  Bottom 0.254: IC101.135 73.56,48.48 76.2,51.12 84.45,51.12 88.27,54.93
  Bottom 0.318: 88.27,54.93 v120.97,54.93
V_BAT_IN
  Top 1.27: J403.1 8.89,67.94 J402.6
V_BATT_FREQ  (via drill 0.3)
  Top 0.635: v23.81,23.18 23.81,18.73 26.04,16.51 IC306.4
  Bottom 0.254: IC101.110 61.06,46.89 60.8,47.15 54.45,47.15 46.67,39.37 40.01,39.37 37.78,37.15 27.3,37.15 23.81,33.66 v23.81,23.18
V_SCAP1
  Top 0.635: R201.2 80.19,65.72 C202.1 82.23,56.2 77.63,51.59 74.3,51.59 73.34,52.55 D202.A
V_SWITCH_ON  (via drill 0.3)
  Top 0.381: R319.2 R320.2 21.91,8.36 v21.91,15.24 | R318.2 44.98,13.23 IC305.8
  Top 1.27: J403.2 9.84,65.41 15.88,71.44 J402.5
  Bottom 0.381: J403.2 3.81,61.59 3.81,23.5 12.06,15.24 v21.91,15.24 39.69,15.24 41.91,13.02 IC305.8
VCAP1  (via drill 0.3)
  Top 0.318: C103.1 62.32,24.05 61.68,23.41 61.61,23.34 61.47,23.2 v60.89,23.2
  Bottom 0.254: IC101.71 61.06,23.36 v60.89,23.2
VCAP2  (via drill 0.3)
  Top 0.254: C102.1 57.79,42.09 57.25,42.63 57.25,43.19 v57.24,43.36
  Bottom 0.254: IC101.106 57.43,43.17 v57.24,43.36
VCP_RX  (via drill 0.3)
  Top 0.318: v50.48,40.32 J401.1 50.48,29.21 53.66,26.04 53.66,25.08 62.23,16.51 76.2,16.51 81.92,22.23 89.85,22.23 v92.71,25.08
  Bottom 0.254: v50.48,40.32 50.8,40.32 52.23,41.75 56.2,41.75 56.77,41.17 IC101.102
  Bottom 0.508: 129.86,28.89 96.52,28.89 v92.71,25.08
  Bottom 0.635: R302.1 144.15,43.18 129.86,28.89
VCP_TX  (via drill 0.3)
  Top 0.318: J401.2 v47.94,37.47 47.94,30.8 53.02,25.72 53.02,24.77 61.91,15.88 76.52,15.88 82.23,21.59 90.81,21.59 v92.39,23.18
  Bottom 0.254: v47.94,37.47 48.9,37.47 52.55,41.12 56.04,41.12 56.48,40.67 IC101.101
  Bottom 0.508: 130.18,27.62 96.84,27.62 v92.39,23.18
  Bottom 0.635: R303.1 146.69,44.13 130.18,27.62
VDD  (via drill 0.3)
  Top 0.254: C115.1 v77.88,47.17 | v71.29,47.41 71.29,46.04 C114.1 | v66.29,47.33 66.29,46.27 C113.1 | C112.1 v57.72,44.63
  Top 0.318: C118.1 64.23,45.87 65.65,47.3 66.26,47.3 v66.29,47.33 | C117.1 58.53,39.55 57.25,38.27 57.25,37.5 v57.24,37.49 57.4,37.33 C111.1 | C110.1 v57.24,33.2 | C109.1 59.78,23.52 v59.94,23.36 | C108.1 66.45,23.82 65.96,23.34 65.52,23.34 v65.5,23.36 | C107.1 v70.58,23.36 | C121.1 79.89,26.22 81.37,27.69 81.37,28.27 v81.37,28.43 80.89,28.76 C120.1 | C105.1 80.72,30.98 81.58,30.13 v81.58,29.46 | C104.1 80.9,36.69 v81.37,36.38 | v77.4,23.36 76.02,23.36 75.25,24.13 75.25,24.94 C106.1 | IC302.8 87.87,50.88 87.47,51.28 81.98,51.28 v77.88,47.17
  Top 0.635: D201.C 73.02,55.56 D202.C | C201.1 D202.C | D202.C 72.07,55.24 70.33,53.5 L101.2 v69.53,42.23 C116.1 | J401.3 45.4,41.59 46.35,42.55 54.61,42.55 56.7,44.63 v57.72,44.63 | v87.29,24.38 81.3,24.38 C121.1
  Bottom 0.254: IC101.144 78.06,46.99 v77.88,47.17 77.56,46.85 IC101.143 77.56,44.15 76.93,43.52 | v71.29,47.41 71.56,47.14 IC101.131 71.56,44.65 72.39,43.81 | 67.36,44.03 66.56,44.84 IC101.121 66.56,47.06 v66.29,47.33 | 60.67,38.43 59.92,37.67 IC101.95 57.42,37.67 v57.24,37.49 | 62.07,33.76 61.49,33.17 IC101.86 57.27,33.17 v57.24,33.2 | 60.52,26.6 60.56,26.57 IC101.72 60.56,23.98 v59.94,23.36 | 65.19,28 65.56,27.63 IC101.62 65.56,23.42 v65.5,23.36 | 69.7,28.32 70.56,27.45 IC101.52 70.56,23.38 v70.58,23.36 | 77.06,26.25 IC101.39 77.06,23.7 v77.4,23.36 | 76.85,28.67 IC101.32 79.93,28.66 80.12,28.47 | 76.85,26.45 76.08,26.45 | 77.17,30.65 78.14,29.67 IC101.30 81.36,29.67 v81.58,29.46 | IC101.33 77.35,28.17 | 76.7,35.47 77.4,36.17 IC101.17 81.17,36.17 v81.37,36.38 | IC101.108 58.18,44.17 v57.72,44.63 | IC101.6 78.19,41.67 78.11,41.59
  Bottom 0.318: 76.39,28.63 76.44,28.67 76.85,28.67 77.35,28.17 77.35,28.28 77.01,28.63 75.92,28.63 75.92,26.6 76.08,26.45 | 77.06,26.25 76.85,26.45 | 72.39,43.81 72.39,41.43
  Bottom 0.635: 81.18,28.47 v81.37,28.43 81.34,28.47 80.12,28.47 | 61.28,44.45 57.9,44.45 v57.72,44.63 | R101.1 86.31,25.37 v87.29,24.38 88.17,25.27 D101.C
  other vias: 69.53,43.18 69.53,44.13
  pour Bottom (isolate 0.381, rank 5, no thermals): 60.1,26.22 78.51,26.22 78.51,43.04 76.93,44.63 60.1,44.63
  pour Top (isolate 0.508, rank 5, no thermals): 79.38,26.04 80.33,26.04 82.23,27.94 82.23,30.16 80.33,32.07 79.38,32.07
XROM_CLK  (via drill 0.3)
  Top 0.318: IC302.6 90.49,49.21 93.03,46.67 93.03,43.81 92.08,42.86 76.2,42.86 72.55,39.21 v72.55,34.77
  Bottom 0.254: IC101.48 72.56,34.76 v72.55,34.77
XROM_IO0  (via drill 0.3)
  Top 0.254: v91.76,49.21 IC302.5
  Bottom 0.254: IC101.20 82.93,34.67 83.82,35.56 83.82,41.27 v91.76,49.21
XROM_IO1  (via drill 0.3)
  Top 0.254: v89.22,44.13 IC302.2
  Bottom 0.254: IC101.21 83.39,34.17 84.45,35.24 84.45,39.37 v89.22,44.13
XROM_IO2  (via drill 0.3)
  Top 0.254: IC302.3 90.49,46.99 89.85,47.62 v88.9,47.62
  Bottom 0.254: IC101.19 82.48,35.17 83.19,35.88 83.19,42.23 88.58,47.62 v88.9,47.62
XROM_IO3  (via drill 0.3)
  Top 0.254: v89.22,49.21 IC302.7
  Bottom 0.254: IC101.18 82.03,35.67 82.55,36.2 82.55,42.55 v89.22,49.21
XROM_NCS  (via drill 0.3)
  Top 0.318: IC302.1 83.27,50.32 v82.87,50.32
  Bottom 0.254: IC101.136 74.06,48.02 76.2,50.16 82.71,50.16 v82.87,50.32
(copper drawn outside any net)
  shapes: Bottom circle x2

## Text on the board
Top: Panel_v2.2 / - RESPATI -